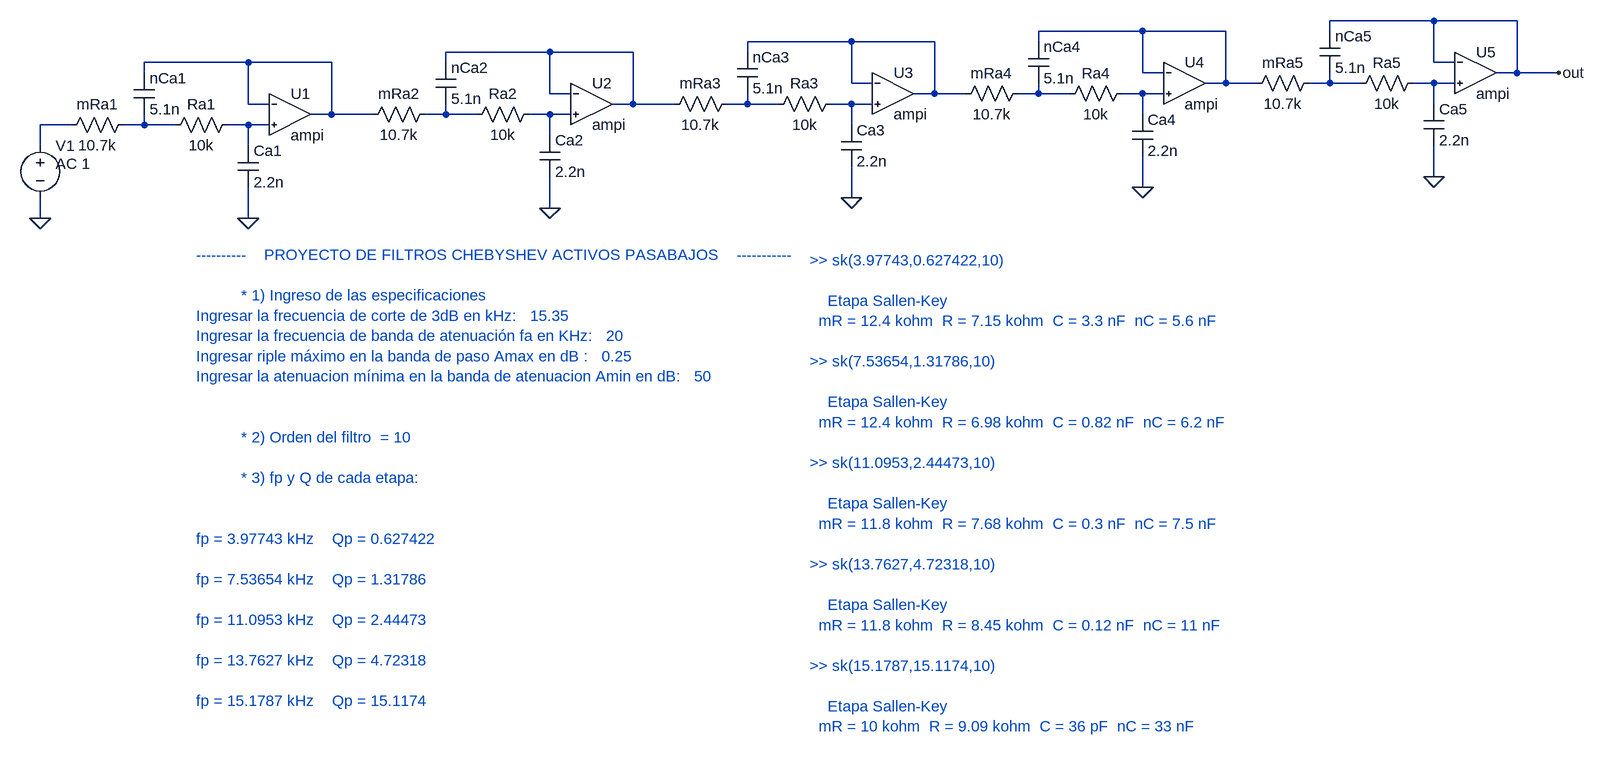
[diagram p0: schematic filtro_problema12_tp7.asc]
filtro_problema12_tp7.asc, the LTspice schematic file:
Version 4
SHEET 1 2104 804
WIRE 1856 -224 1696 -224
WIRE 1984 -224 1856 -224
WIRE 1408 -208 1248 -208
WIRE 1536 -208 1408 -208
WIRE 1696 -208 1696 -224
WIRE 960 -192 800 -192
WIRE 1088 -192 960 -192
WIRE 1248 -192 1248 -208
WIRE 496 -176 336 -176
WIRE 624 -176 496 -176
WIRE 800 -176 800 -192
WIRE 32 -160 -128 -160
WIRE 160 -160 32 -160
WIRE 336 -160 336 -176
WIRE 1856 -160 1856 -224
WIRE 1888 -160 1856 -160
WIRE -128 -144 -128 -160
WIRE 1408 -144 1408 -208
WIRE 1440 -144 1408 -144
WIRE 1984 -144 1984 -224
WIRE 1984 -144 1952 -144
WIRE 2048 -144 1984 -144
WIRE 960 -128 960 -192
WIRE 992 -128 960 -128
WIRE 1536 -128 1536 -208
WIRE 1536 -128 1504 -128
WIRE 1584 -128 1536 -128
WIRE 1696 -128 1696 -144
WIRE 1696 -128 1664 -128
WIRE 1744 -128 1696 -128
WIRE 1856 -128 1824 -128
WIRE 1888 -128 1856 -128
WIRE 496 -112 496 -176
WIRE 528 -112 496 -112
WIRE 1088 -112 1088 -192
WIRE 1088 -112 1056 -112
WIRE 1136 -112 1088 -112
WIRE 1248 -112 1248 -128
WIRE 1248 -112 1216 -112
WIRE 1296 -112 1248 -112
WIRE 1408 -112 1376 -112
WIRE 1440 -112 1408 -112
WIRE 32 -96 32 -160
WIRE 64 -96 32 -96
WIRE 624 -96 624 -176
WIRE 624 -96 592 -96
WIRE 688 -96 624 -96
WIRE 800 -96 800 -112
WIRE 800 -96 768 -96
WIRE 848 -96 800 -96
WIRE 960 -96 928 -96
WIRE 992 -96 960 -96
WIRE 1856 -96 1856 -128
WIRE 160 -80 160 -160
WIRE 160 -80 128 -80
WIRE 224 -80 160 -80
WIRE 336 -80 336 -96
WIRE 336 -80 304 -80
WIRE 384 -80 336 -80
WIRE 496 -80 464 -80
WIRE 528 -80 496 -80
WIRE 1408 -80 1408 -112
WIRE -240 -64 -288 -64
WIRE -128 -64 -128 -80
WIRE -128 -64 -160 -64
WIRE -80 -64 -128 -64
WIRE 32 -64 0 -64
WIRE 64 -64 32 -64
WIRE 960 -64 960 -96
WIRE 496 -48 496 -80
WIRE -288 -32 -288 -64
WIRE 32 -32 32 -64
WIRE 1856 16 1856 -32
WIRE 1408 32 1408 -16
WIRE 960 48 960 0
WIRE 496 64 496 16
WIRE -288 80 -288 48
WIRE 32 80 32 32
FLAG 32 80 0
FLAG -288 80 0
FLAG 496 64 0
FLAG 960 48 0
FLAG 1408 32 0
FLAG 1856 16 0
FLAG 2048 -144 out
SYMBOL Circuitos2\\ComponentesIdeales\\ampi 96 -144 R0
SYMATTR InstName U1
SYMBOL cap -144 -144 R0
SYMATTR InstName nCa1
SYMATTR Value 5.1n
SYMBOL res 16 -80 R90
WINDOW 0 0 56 VBottom 2
WINDOW 3 32 56 VTop 2
SYMATTR InstName Ra1
SYMATTR Value 10k
SYMBOL cap 16 -32 R0
SYMATTR InstName Ca1
SYMATTR Value 2.2n
SYMBOL res -144 -80 R90
WINDOW 0 0 56 VBottom 2
WINDOW 3 32 56 VTop 2
SYMATTR InstName mRa1
SYMATTR Value 10.7k
SYMBOL voltage -288 -48 R0
WINDOW 123 24 44 Left 2
WINDOW 39 0 0 Left 0
SYMATTR InstName V1
SYMATTR Value ""
SYMATTR Value2 AC 1
SYMBOL Circuitos2\\ComponentesIdeales\\ampi 560 -160 R0
SYMATTR InstName U2
SYMBOL cap 320 -160 R0
SYMATTR InstName nCa2
SYMATTR Value 5.1n
SYMBOL res 480 -96 R90
WINDOW 0 0 56 VBottom 2
WINDOW 3 32 56 VTop 2
SYMATTR InstName Ra2
SYMATTR Value 10k
SYMBOL cap 480 -48 R0
SYMATTR InstName Ca2
SYMATTR Value 2.2n
SYMBOL res 320 -96 R90
WINDOW 0 0 56 VBottom 2
WINDOW 3 32 56 VTop 2
SYMATTR InstName mRa2
SYMATTR Value 10.7k
SYMBOL Circuitos2\\ComponentesIdeales\\ampi 1024 -176 R0
SYMATTR InstName U3
SYMBOL cap 784 -176 R0
SYMATTR InstName nCa3
SYMATTR Value 5.1n
SYMBOL res 944 -112 R90
WINDOW 0 0 56 VBottom 2
WINDOW 3 32 56 VTop 2
SYMATTR InstName Ra3
SYMATTR Value 10k
SYMBOL cap 944 -64 R0
SYMATTR InstName Ca3
SYMATTR Value 2.2n
SYMBOL res 784 -112 R90
WINDOW 0 0 56 VBottom 2
WINDOW 3 32 56 VTop 2
SYMATTR InstName mRa3
SYMATTR Value 10.7k
SYMBOL Circuitos2\\ComponentesIdeales\\ampi 1472 -192 R0
SYMATTR InstName U4
SYMBOL cap 1232 -192 R0
SYMATTR InstName nCa4
SYMATTR Value 5.1n
SYMBOL res 1392 -128 R90
WINDOW 0 0 56 VBottom 2
WINDOW 3 32 56 VTop 2
SYMATTR InstName Ra4
SYMATTR Value 10k
SYMBOL cap 1392 -80 R0
SYMATTR InstName Ca4
SYMATTR Value 2.2n
SYMBOL res 1232 -128 R90
WINDOW 0 0 56 VBottom 2
WINDOW 3 32 56 VTop 2
SYMATTR InstName mRa4
SYMATTR Value 10.7k
SYMBOL Circuitos2\\ComponentesIdeales\\ampi 1920 -208 R0
SYMATTR InstName U5
SYMBOL cap 1680 -208 R0
SYMATTR InstName nCa5
SYMATTR Value 5.1n
SYMBOL res 1840 -144 R90
WINDOW 0 0 56 VBottom 2
WINDOW 3 32 56 VTop 2
SYMATTR InstName Ra5
SYMATTR Value 10k
SYMBOL cap 1840 -96 R0
SYMATTR InstName Ca5
SYMATTR Value 2.2n
SYMBOL res 1680 -144 R90
WINDOW 0 0 56 VBottom 2
WINDOW 3 32 56 VTop 2
SYMATTR InstName mRa5
SYMATTR Value 10.7k
TEXT -48 136 Left 2 ;----------    PROYECTO DE FILTROS CHEBYSHEV ACTIVOS PASABAJOS    -----------\n \n          * 1) Ingreso de las especificaciones   \nIngresar la frecuencia de corte de 3dB en kHz:   15.35\nIngresar la frecuencia de banda de atenuación fa en KHz:   20\nIngresar riple máximo en la banda de paso Amax en dB :   0.25\nIngresar la atenuacion mínima en la banda de atenuacion Amin en dB:   50\n \n \n          * 2) Orden del filtro  = 10  \n \n          * 3) fp y Q de cada etapa: \n \n \nfp = 3.97743 kHz    Qp = 0.627422  \n \nfp = 7.53654 kHz    Qp = 1.31786  \n \nfp = 11.0953 kHz    Qp = 2.44473  \n \nfp = 13.7627 kHz    Qp = 4.72318  \n \nfp = 15.1787 kHz    Qp = 15.1174
TEXT 896 144 Left 2 ;>> sk(3.97743,0.627422,10)\n \n    Etapa Sallen-Key\n  mR = 12.4 kohm  R = 7.15 kohm  C = 3.3 nF  nC = 5.6 nF\n \n>> sk(7.53654,1.31786,10)\n \n    Etapa Sallen-Key\n  mR = 12.4 kohm  R = 6.98 kohm  C = 0.82 nF  nC = 6.2 nF\n \n>> sk(11.0953,2.44473,10)\n \n    Etapa Sallen-Key\n  mR = 11.8 kohm  R = 7.68 kohm  C = 0.3 nF  nC = 7.5 nF\n \n>> sk(13.7627,4.72318,10)\n \n    Etapa Sallen-Key\n  mR = 11.8 kohm  R = 8.45 kohm  C = 0.12 nF  nC = 11 nF\n \n>> sk(15.1787,15.1174,10)\n \n    Etapa Sallen-Key\n  mR = 10 kohm  R = 9.09 kohm  C = 36 pF  nC = 33 nF

The netlist it stands for:
* filtro_problema12_tp7.asc
XU1 N015 N004 N004 ampi Ren=1e9, Rsal=1, A=1e9  ; pins p n s
C§nCa1 N004 N014 5.1n
Ra1 N015 N014 10k
Ca1 N015 0 2.2n
R§mRa1 N014 N013 10.7k
V1 N013 0 AC 1
XU2 N012 N003 N003 ampi Ren=1e9, Rsal=1, A=1e9  ; pins p n s
C§nCa2 N003 N011 5.1n
Ra2 N012 N011 10k
Ca2 N012 0 2.2n
R§mRa2 N011 N004 10.7k
XU3 N010 N002 N002 ampi Ren=1e9, Rsal=1, A=1e9  ; pins p n s
C§nCa3 N002 N009 5.1n
Ra3 N010 N009 10k
Ca3 N010 0 2.2n
R§mRa3 N009 N003 10.7k
XU4 N008 N001 N001 ampi Ren=1e9, Rsal=1, A=1e9  ; pins p n s
C§nCa4 N001 N007 5.1n
Ra4 N008 N007 10k
Ca4 N008 0 2.2n
R§mRa4 N007 N002 10.7k
XU5 N006 out out ampi Ren=1e9, Rsal=1, A=1e9  ; pins p n s
C§nCa5 out N005 5.1n
Ra5 N006 N005 10k
Ca5 N006 0 2.2n
R§mRa5 N005 N001 10.7k
* ----------    PROYECTO DE FILTROS CHEBYSHEV ACTIVOS PASABAJOS    -----------
*           * 1) Ingreso de las especificaciones
* Ingresar la frecuencia de corte de 3dB en kHz:   15.35
* Ingresar la frecuencia de banda de atenuación fa en KHz:   20
* Ingresar riple máximo en la banda de paso Amax en dB :   0.25
* Ingresar la atenuacion mínima en la banda de atenuacion Amin en dB:   50
*           * 2) Orden del filtro  = 10
*           * 3) fp y Q de cada etapa:
* fp = 3.97743 kHz    Qp = 0.627422
* fp = 7.53654 kHz    Qp = 1.31786
* fp = 11.0953 kHz    Qp = 2.44473
* fp = 13.7627 kHz    Qp = 4.72318
* fp = 15.1787 kHz    Qp = 15.1174
* >> sk(3.97743,0.627422,10)
*     Etapa Sallen-Key
*   mR = 12.4 kohm  R = 7.15 kohm  C = 3.3 nF  nC = 5.6 nF
* >> sk(7.53654,1.31786,10)
*     Etapa Sallen-Key
*   mR = 12.4 kohm  R = 6.98 kohm  C = 0.82 nF  nC = 6.2 nF
* >> sk(11.0953,2.44473,10)
*     Etapa Sallen-Key
*   mR = 11.8 kohm  R = 7.68 kohm  C = 0.3 nF  nC = 7.5 nF
* >> sk(13.7627,4.72318,10)
*     Etapa Sallen-Key
*   mR = 11.8 kohm  R = 8.45 kohm  C = 0.12 nF  nC = 11 nF
* >> sk(15.1787,15.1174,10)
*     Etapa Sallen-Key
*   mR = 10 kohm  R = 9.09 kohm  C = 36 pF  nC = 33 nF
.lib ..\sym\Circuitos2\ComponentesIdeales\compoideales.lib
.backanno
.end